# Altium schematic sheet Pneumatics_Board_Top.SchDoc
size A
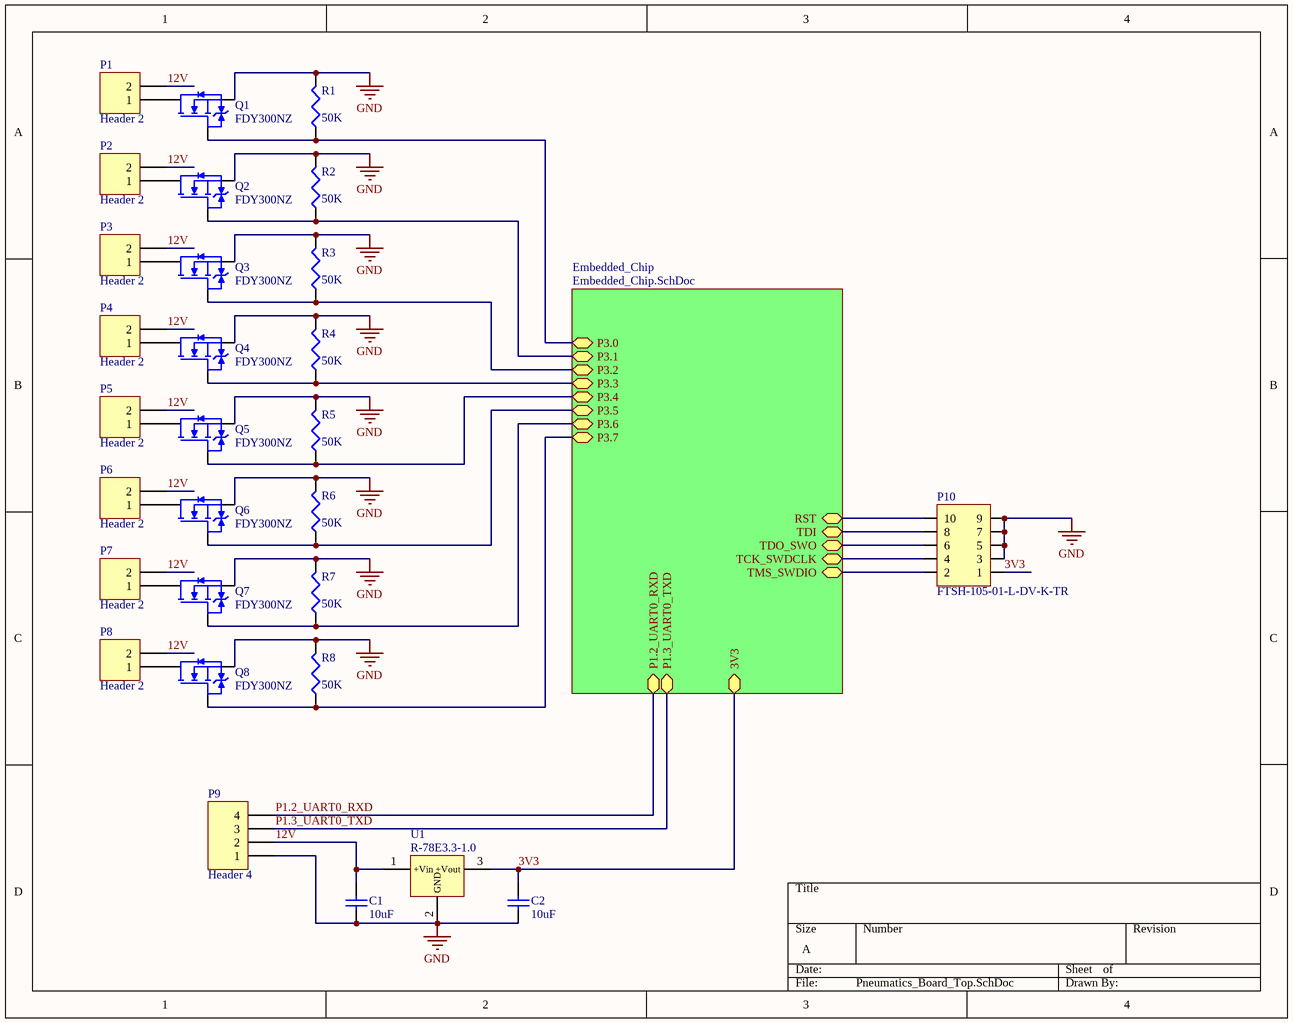
[diagram p0: Pneumatics_Board_Top.SchDoc]

## Parts
C1  value 10uF  [C1206]  (hidden comment: Cap Semi)
C2  value 10uF  [C1206]  (hidden comment: Cap Semi)
P1  Header 2  [HDR1X2]
P2  Header 2  [HDR1X2]
P3  Header 2  [HDR1X2]
P4  Header 2  [HDR1X2]
P5  Header 2  [HDR1X2]
P6  Header 2  [HDR1X2]
P7  Header 2  [HDR1X2]
P8  Header 2  [HDR1X2]
P9  Header 4  [HDR1X4]
P10  FTSH-105-01-L-DV-K-TR  [FTSH-105-01-L-DV-K-TR]
Q1  FDY300NZ  [FDY300NZ]
Q2  FDY300NZ  [FDY300NZ]
Q3  FDY300NZ  [FDY300NZ]
Q4  FDY300NZ  [FDY300NZ]
Q5  FDY300NZ  [FDY300NZ]
Q6  FDY300NZ  [FDY300NZ]
Q7  FDY300NZ  [FDY300NZ]
Q8  FDY300NZ  [FDY300NZ]
R1  value 50K  [J1-0603]  (hidden comment: Res3)
R2  value 50K  [J1-0603]  (hidden comment: Res3)
R3  value 50K  [J1-0603]  (hidden comment: Res3)
R4  value 50K  [J1-0603]  (hidden comment: Res3)
R5  value 50K  [J1-0603]  (hidden comment: Res3)
R6  value 50K  [J1-0603]  (hidden comment: Res3)
R7  value 50K  [J1-0603]  (hidden comment: Res3)
R8  value 50K  [J1-0603]  (hidden comment: Res3)
U1  R-78E3.3-1.0  [R-78Exx-1.0]

## Sub-sheets
Embedded_Chip = Embedded_Chip.SchDoc: 3V3, TMS_SWDIO, TCK_SWDCLK, TDO_SWO, TDI, RST, P3.0, P3.1, P3.2, P3.3, P3.4, P3.5, P3.6, P3.7, P1.2_UART0_RXD, P1.3_UART0_TXD

## Nets
GND: C1.1 C2.1 P9.1 P10.3 P10.5 P10.7 P10.9 Q1.2(Source) Q2.2(Source) Q3.2(Source) Q4.2(Source) Q5.2(Source) Q6.2(Source) Q7.2(Source) Q8.2(Source) R1.2 R2.2 R3.2 R4.2 R5.2 R6.2 R7.2 R8.2 U1.2(GND)
3V3: C2.2 P10.1 U1.3(+Vout) ; sheet Embedded_Chip/3V3
12V: C1.2 P1.2 P2.2 P3.2 P4.2 P5.2 P6.2 P7.2 P8.2 P9.2 U1.1(+Vin)
P1.2_UART0_RXD: P9.4 ; sheet Embedded_Chip/P1.2_UART0_RXD
P1.3_UART0_TXD: P9.3 ; sheet Embedded_Chip/P1.3_UART0_TXD
NetP1_1: P1.1 Q1.3(Drain)
NetP2_1: P2.1 Q2.3(Drain)
NetP3_1: P3.1 Q3.3(Drain)
NetP4_1: P4.1 Q4.3(Drain)
NetP5_1: P5.1 Q5.3(Drain)
NetP6_1: P6.1 Q6.3(Drain)
NetP7_1: P7.1 Q7.3(Drain)
NetP8_1: P8.1 Q8.3(Drain)
NetP10_2: P10.2 ; sheet Embedded_Chip/TMS_SWDIO
NetP10_4: P10.4 ; sheet Embedded_Chip/TCK_SWDCLK
NetP10_6: P10.6 ; sheet Embedded_Chip/TDO_SWO
NetP10_8: P10.8 ; sheet Embedded_Chip/TDI
NetP10_10: P10.10 ; sheet Embedded_Chip/RST
NetQ1_1: Q1.1(Gate) R1.1 ; sheet Embedded_Chip/P3.0
NetQ2_1: Q2.1(Gate) R2.1 ; sheet Embedded_Chip/P3.1
NetQ3_1: Q3.1(Gate) R3.1 ; sheet Embedded_Chip/P3.2
NetQ4_1: Q4.1(Gate) R4.1 ; sheet Embedded_Chip/P3.3
NetQ5_1: Q5.1(Gate) R5.1 ; sheet Embedded_Chip/P3.4
NetQ6_1: Q6.1(Gate) R6.1 ; sheet Embedded_Chip/P3.5
NetQ7_1: Q7.1(Gate) R7.1 ; sheet Embedded_Chip/P3.6
NetQ8_1: Q8.1(Gate) R8.1 ; sheet Embedded_Chip/P3.7

## Library data of the parts
C1 C2 = Cap Semi: Capacitor (Semiconductor SIM Model); Published: 8-Jun-2000; LatestRevisionDate: 29-May-2009; LatestRevisionNote: IPC-7351 Footprint Added.; PackageReference: C1206; Publisher: Altium Limited; PackageDescription: Chip Capacitor
P1-P8 = Header 2: Header, 2-Pin; LatestRevisionDate: 17-Jul-2002; LatestRevisionNote: Re-released for DXP Platform.; Publisher: Altium Limited
P9 = Header 4: Header, 4-Pin; LatestRevisionDate: 17-Jul-2002; LatestRevisionNote: Re-released for DXP Platform.; Publisher: Altium Limited
P10 = JTAG Header: CONN HEADER 10POS DUAL .05" SMD; Digikey Link: https://www.digikey.com/product-detail/en/samtec-inc/FTSH-105-01-L-DV-K-TR/SAM13165CT-ND/8827920; Drawings: http://suddendocs.samtec.com/prints/ftsh-1xx-xx-xxx-dv-xxx-xxx-mkt.pdf; Datasheet: http://suddendocs.samtec.com/catalog_english/ftsh_smt.pdf
Q1-Q8 = FDY300NZ: N-Channel 20V 600mA (Ta) 625mW (Ta) Surface Mount SC-89-3; Digikey: https://www.digikey.com/product-detail/en/on-semiconductor/FDY300NZ/FDY300NZCT-ND/1923099; Datasheet: https://www.fairchildsemi.com/datasheets/FD/FDY300NZ.pdf
R1-R8 = Res3: Resistor; Published: 8-Jun-2000; LatestRevisionDate: 29-May-2009; LatestRevisionNote: IPC-7351 Footprint Added.; PackageReference: J1-0603; Publisher: Altium Limited; PackageDescription: Chip Resistor
U1 = R-78Exx-1.0: 1A DC/DC Voltage Converter; Datasheet: https://www.recom-power.com/pdf/Innoline/R-78Exx-1.0.pdf; Digikey: https://www.digikey.com/product-detail/en/recom-power/R-78E3.3-1.0/945-2409-5-ND/5327711